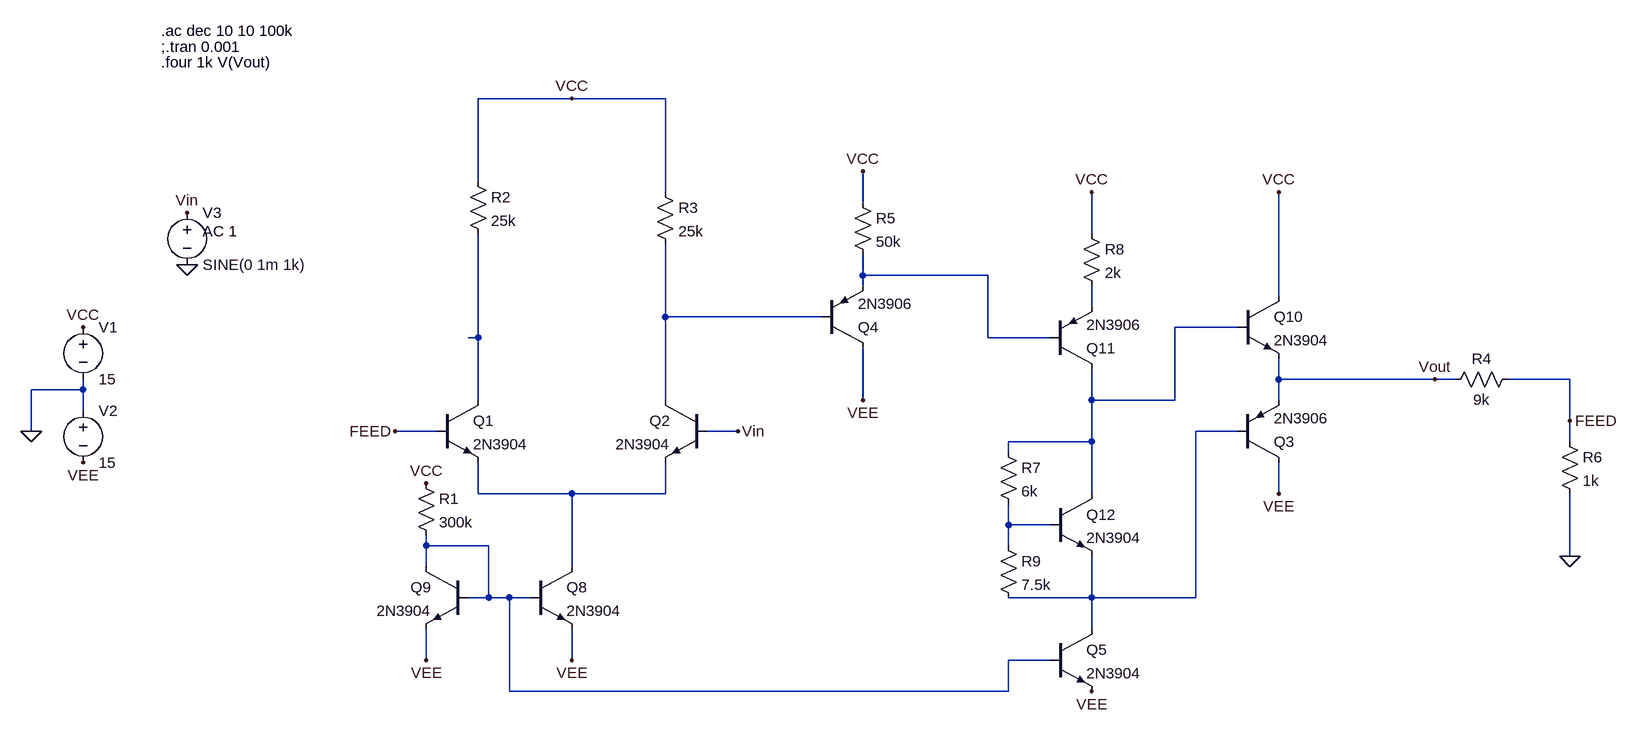
[diagram p0: schematic differentail_bjt.asc]
differentail_bjt.asc, the LTspice schematic file:
Version 4
SHEET 1 2040 704
WIRE 448 -960 304 -960
WIRE 592 -960 448 -960
WIRE 304 -832 304 -960
WIRE 592 -816 592 -960
WIRE 896 -800 896 -848
WIRE 1248 -752 1248 -816
WIRE 896 -688 896 -720
WIRE 1088 -688 896 -688
WIRE 896 -672 896 -688
WIRE 1536 -656 1536 -816
WIRE 1248 -640 1248 -672
WIRE 592 -624 592 -736
WIRE 832 -624 592 -624
WIRE 1472 -608 1376 -608
WIRE 304 -592 304 -752
WIRE 304 -592 288 -592
WIRE 1088 -592 1088 -688
WIRE 1184 -592 1088 -592
WIRE 1536 -528 1536 -560
WIRE 1776 -528 1536 -528
WIRE 1808 -528 1776 -528
WIRE 1984 -528 1888 -528
WIRE -304 -512 -304 -528
WIRE -304 -512 -384 -512
WIRE 304 -496 304 -592
WIRE 592 -496 592 -624
WIRE 896 -496 896 -576
WIRE 1248 -496 1248 -544
WIRE 1376 -496 1376 -608
WIRE 1376 -496 1248 -496
WIRE 1536 -496 1536 -528
WIRE -304 -480 -304 -512
WIRE 1984 -464 1984 -528
WIRE -384 -448 -384 -512
WIRE 240 -448 176 -448
WIRE 704 -448 656 -448
WIRE 1472 -448 1408 -448
WIRE 1248 -432 1248 -496
WIRE 1248 -432 1120 -432
WIRE 1984 -432 1984 -464
WIRE 1120 -416 1120 -432
WIRE 304 -352 304 -400
WIRE 448 -352 304 -352
WIRE 592 -352 592 -400
WIRE 592 -352 448 -352
WIRE 1248 -352 1248 -432
WIRE 1536 -352 1536 -400
WIRE 1120 -304 1120 -336
WIRE 1184 -304 1120 -304
WIRE 224 -272 224 -288
WIRE 320 -272 224 -272
WIRE 1120 -272 1120 -304
WIRE 1984 -256 1984 -352
WIRE 224 -240 224 -272
WIRE 448 -240 448 -352
WIRE 320 -192 320 -272
WIRE 320 -192 288 -192
WIRE 352 -192 320 -192
WIRE 384 -192 352 -192
WIRE 1248 -192 1248 -256
WIRE 1248 -192 1120 -192
WIRE 1408 -192 1408 -448
WIRE 1408 -192 1248 -192
WIRE 1248 -144 1248 -192
WIRE 224 -96 224 -144
WIRE 448 -96 448 -144
WIRE 1184 -96 1120 -96
WIRE 352 -48 352 -192
WIRE 1120 -48 1120 -96
WIRE 1120 -48 352 -48
FLAG 224 -368 VCC
FLAG 1536 -816 VCC
FLAG 224 -96 VEE
FLAG 1536 -352 VEE
FLAG 1776 -528 Vout
FLAG 1984 -256 0
FLAG -144 -784 Vin
FLAG -304 -608 VCC
FLAG -304 -400 VEE
FLAG -384 -448 0
FLAG -144 -704 0
FLAG 1248 -816 VCC
FLAG 704 -448 Vin
FLAG 896 -496 VEE
FLAG 896 -848 VCC
FLAG 448 -96 VEE
FLAG 448 -960 VCC
FLAG 1248 -48 VEE
FLAG 1984 -464 FEED
FLAG 176 -448 FEED
DATAFLAG 448 -352 ""
DATAFLAG 1664 -528 ""
DATAFLAG 288 -592 ""
DATAFLAG 1088 -688 ""
DATAFLAG 704 -624 ""
DATAFLAG 1344 -496 ""
DATAFLAG 1376 -192 ""
SYMBOL npn 240 -496 R0
SYMATTR InstName Q1
SYMATTR Value 2N3904
SYMBOL npn 656 -496 M0
SYMATTR InstName Q2
SYMATTR Value 2N3904
SYMBOL pnp 1472 -400 M180
SYMATTR InstName Q3
SYMATTR Value 2N3906
SYMBOL npn 384 -240 R0
SYMATTR InstName Q8
SYMATTR Value 2N3904
SYMBOL npn 288 -240 M0
SYMATTR InstName Q9
SYMATTR Value 2N3904
SYMBOL res 208 -384 R0
SYMATTR InstName R1
SYMATTR Value 300k
SYMBOL npn 1472 -656 R0
SYMATTR InstName Q10
SYMATTR Value 2N3904
SYMBOL res 1968 -448 R0
SYMATTR InstName R6
SYMATTR Value 1k
SYMBOL voltage -304 -624 R0
WINDOW 123 0 0 Left 0
WINDOW 39 0 0 Left 0
SYMATTR InstName V1
SYMATTR Value 15
SYMBOL voltage -304 -496 R0
WINDOW 123 0 0 Left 0
WINDOW 39 0 0 Left 0
SYMATTR InstName V2
SYMATTR Value 15
SYMBOL voltage -144 -800 R0
WINDOW 123 24 44 Left 2
WINDOW 39 0 0 Left 0
SYMATTR InstName V3
SYMATTR Value SINE(0 1m 1k)
SYMATTR Value2 AC 1
SYMBOL pnp 1184 -544 M180
SYMATTR InstName Q11
SYMATTR Value 2N3906
SYMBOL res 1232 -768 R0
SYMATTR InstName R8
SYMATTR Value 2k
SYMBOL npn 1184 -352 R0
SYMATTR InstName Q12
SYMATTR Value 2N3904
SYMBOL res 1904 -544 R90
WINDOW 0 0 56 VBottom 2
WINDOW 3 32 56 VTop 2
SYMATTR InstName R4
SYMATTR Value 9k
SYMBOL pnp 832 -576 M180
SYMATTR InstName Q4
SYMATTR Value 2N3906
SYMBOL res 880 -816 R0
SYMATTR InstName R5
SYMATTR Value 50k
SYMBOL res 288 -848 R0
SYMATTR InstName R2
SYMATTR Value 25k
SYMBOL res 576 -832 R0
SYMATTR InstName R3
SYMATTR Value 25k
SYMBOL res 1104 -432 R0
SYMATTR InstName R7
SYMATTR Value 6k
SYMBOL res 1104 -288 R0
SYMATTR InstName R9
SYMATTR Value 7.5k
SYMBOL npn 1184 -144 R0
SYMATTR InstName Q5
SYMATTR Value 2N3904
TEXT -184 -1064 Left 2 !.ac dec 10 10 100k
TEXT -184 -1040 Left 2 !;.tran 0.001
TEXT -184 -1016 Left 2 !.four 1k V(Vout)

The netlist it stands for:
* differentail_bjt.asc
Q1 N005 FEED N007 0 2N3904
Q2 N003 Vin N007 0 2N3904
Q3 VEE N006 Vout 0 2N3906
Q8 N007 N009 VEE 0 2N3904
Q9 N009 N009 VEE 0 2N3904
R1 VCC N009 300k
Q10 VCC N004 Vout 0 2N3904
R6 FEED 0 1k
V1 VCC 0 15
V2 0 VEE 15
V3 Vin 0 SINE(0 1m 1k) AC 1
Q11 N004 N001 N002 0 2N3906
R8 VCC N002 2k
Q12 N004 N008 N006 0 2N3904
R4 FEED Vout 9k
Q4 VEE N003 N001 0 2N3906
R5 VCC N001 50k
R2 VCC N005 25k
R3 VCC N003 25k
R7 N004 N008 6k
R9 N008 N006 7.5k
Q5 N006 N009 VEE 0 2N3904
.model NPN NPN
.model PNP PNP
.lib standard.bjt
.ac dec 10 10 100k
;.tran 0.001
.four 1k V(Vout)
.backanno
.end